# Altium schematic sheet Power Board.DCIN.SchDoc
size A4; SheetNumber: 1; SheetTotal: 2
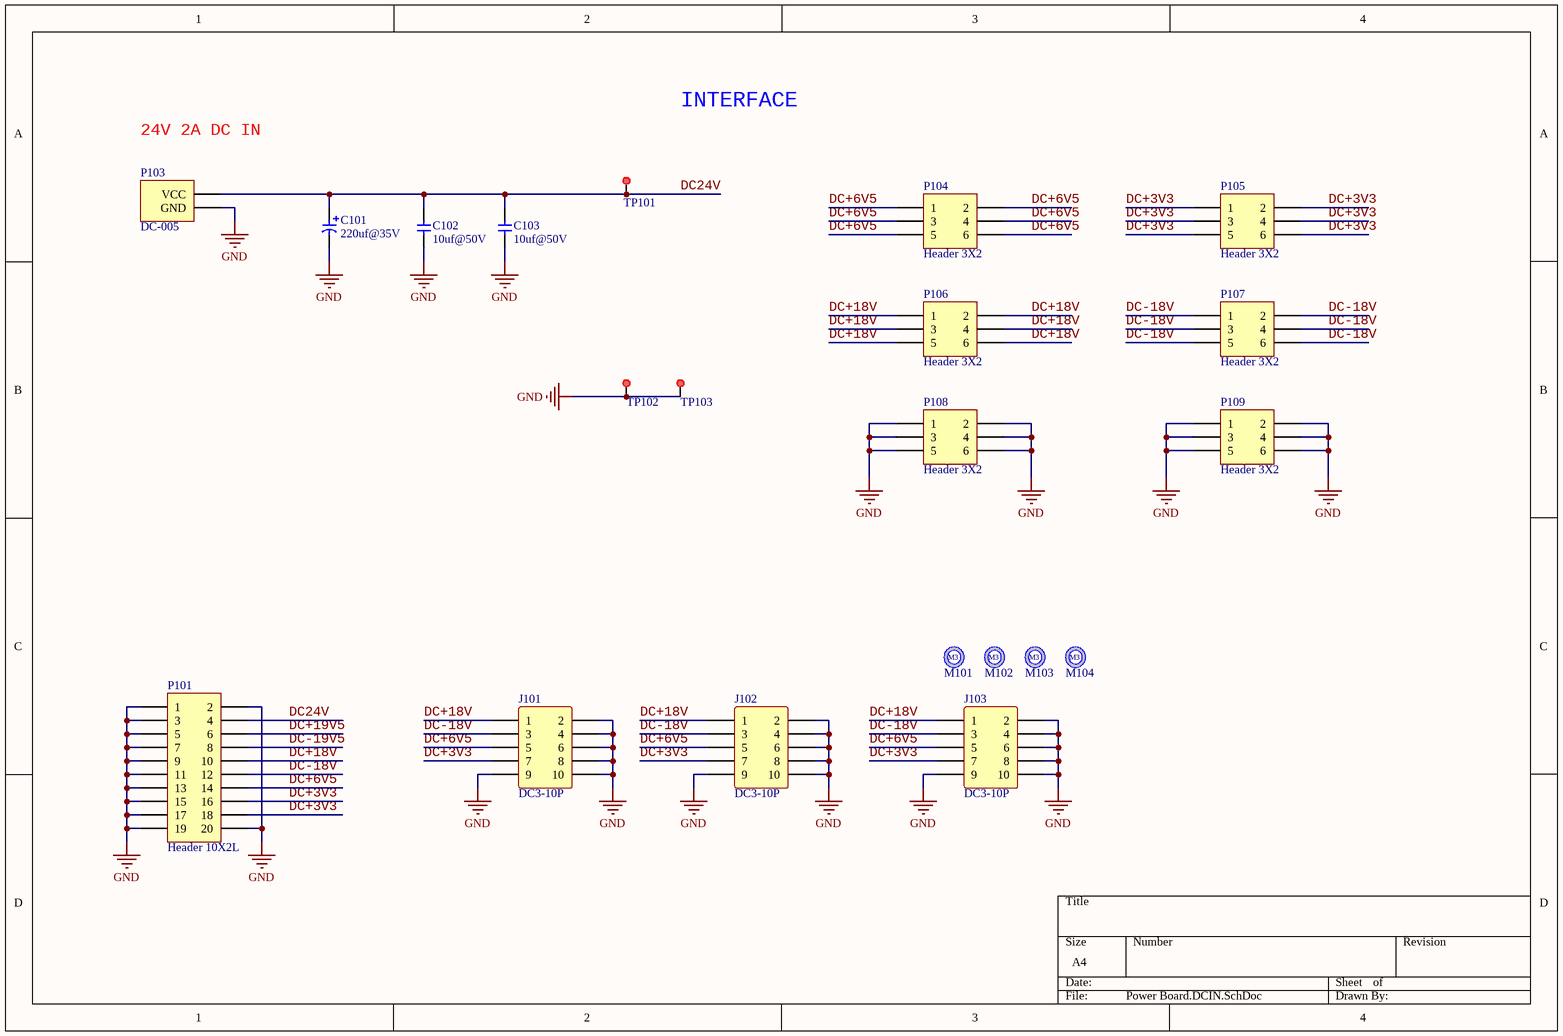
[diagram p0: Power Board.DCIN.SchDoc]

## Parts
C101  value 220uf@35V  [C8X12]  (hidden comment: Cap2)
C102  value 10uf@50V  [C1206]  (hidden comment: Cap)
C103  value 10uf@50V  [C1206]  (hidden comment: Cap)
J101  DC3-10P  [DC3-10P]
J102  DC3-10P  [DC3-10P]
J103  DC3-10P  [DC3-10P]
M101  M3  [M3-3.2X5]  (value not drawn)
M102  M3  [M3-3.2X5]  (value not drawn)
M103  M3  [M3-3.2X5]  (value not drawn)
M104  M3  [M3-3.2X5]  (value not drawn)
P101  Header 10X2L  [HDR2X10LML]
P103  DC-005  [DC-005]
P104  Header 3X2  [HDR2X3]
P105  Header 3X2  [HDR2X3]
P106  Header 3X2  [HDR2X3]
P107  Header 3X2  [HDR2X3]
P108  Header 3X2  [HDR2X3]
P109  Header 3X2  [HDR2X3]
TP101  TestPoint  [TestPoint-THM1.0-L]  (value not drawn)
TP102  TestPoint  [TestPoint-THM1.0-L]  (value not drawn)
TP103  TestPoint  [TestPoint-THM1.0-L]  (value not drawn)

## Nets
GND: C101.2 C102.1 C103.1 J101.2 J101.4 J101.6 J101.8 J101.9 J101.10 J102.2 J102.4 J102.6 J102.8 J102.9 J102.10 J103.2 J103.4 J103.6 J103.8 J103.9 J103.10 P101.1 P101.2 P101.3 P101.5 P101.7 P101.9 P101.11 P101.13 P101.15 P101.17 P101.19 P101.20 P103.2(GND) P108.1 P108.2 P108.3 P108.4 P108.5 P108.6 P109.1 P109.2 P109.3 P109.4 P109.5 P109.6 TP102.1 TP103.1
DC24V: C101.1 C102.2 C103.2 P101.4 P103.1(VCC) TP101.1
DC+3V3: J101.7 J102.7 J103.7 P101.16 P101.18 P105.1 P105.2 P105.3 P105.4 P105.5 P105.6
DC+6V5: J101.5 J102.5 J103.5 P101.14 P104.1 P104.2 P104.3 P104.4 P104.5 P104.6
DC+18V: J101.1 J102.1 J103.1 P101.10 P106.1 P106.2 P106.3 P106.4 P106.5 P106.6
DC+19V5: P101.6
DC-18V: J101.3 J102.3 J103.3 P101.12 P107.1 P107.2 P107.3 P107.4 P107.5 P107.6
DC-19V5: P101.8

## Notes on the sheet
- INTERFACE
- 24V 2A DC IN

## Library data of the parts
P101 = Header 10X2L: Header, 10-Pin, Dual row, Pin 1 on Left
P104-P109 = Header 3X2: Header, 3-Pin, Dual row
TP101-TP103 = TestPoint: 测试点